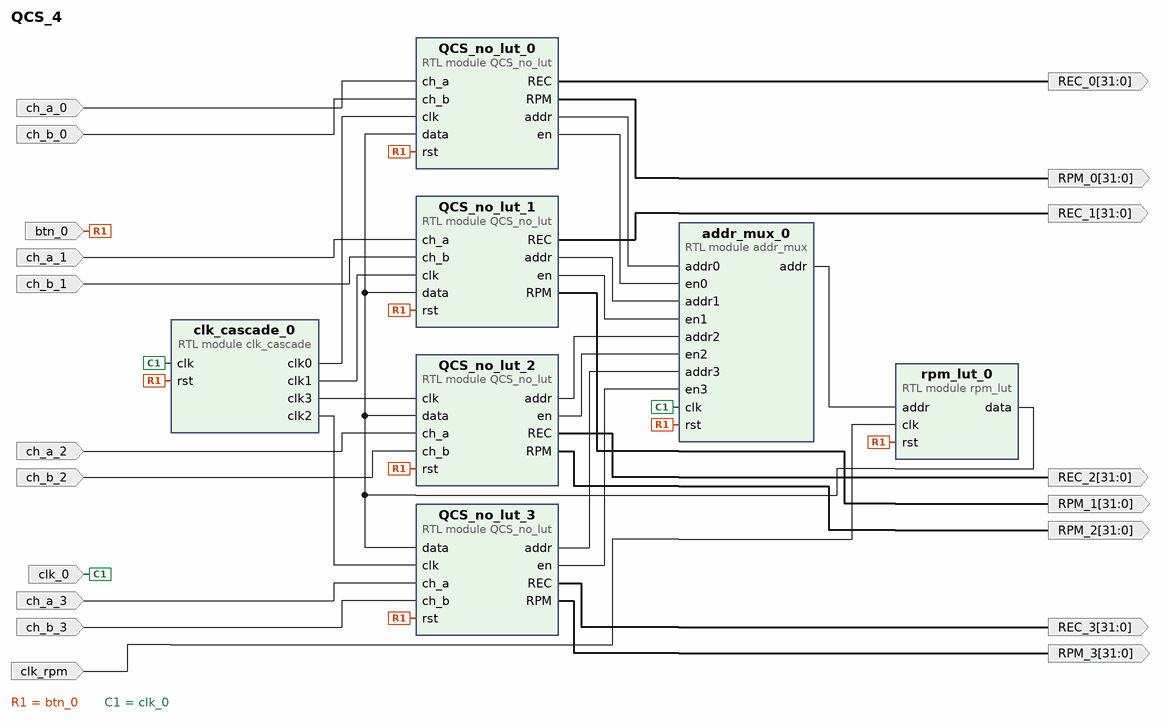
[diagram p0: block diagram of the top level]
# Vivado block design QCS_4, xc7a35ticsg324-1L, Vivado 2023.1
create_bd_design QCS_4

create_bd_port -dir O -from 31 -to 0 REC_0
create_bd_port -dir O -from 31 -to 0 RPM_0
create_bd_port -dir I ch_a_0
create_bd_port -dir I ch_b_0
create_bd_port -dir O -from 31 -to 0 REC_1
create_bd_port -dir O -from 31 -to 0 RPM_1
create_bd_port -dir I ch_a_1
create_bd_port -dir I ch_b_1
create_bd_port -dir O -from 31 -to 0 REC_2
create_bd_port -dir O -from 31 -to 0 RPM_2
create_bd_port -dir I ch_a_2
create_bd_port -dir I ch_b_2
create_bd_port -dir O -from 31 -to 0 REC_3
create_bd_port -dir O -from 31 -to 0 RPM_3
create_bd_port -dir I ch_a_3
create_bd_port -dir I ch_b_3
create_bd_port -dir I btn_0
create_bd_port -dir I -type clk clk_0
create_bd_port -dir I -type clk clk_rpm
set_property -dict {CONFIG.FREQ_HZ 400000000} [get_bd_ports clk_rpm]

create_bd_cell -type module -reference rpm_lut rpm_lut_0
create_bd_cell -type module -reference clk_cascade clk_cascade_0
create_bd_cell -type module -reference addr_mux addr_mux_0
create_bd_cell -type module -reference QCS_no_lut QCS_no_lut_0
create_bd_cell -type module -reference QCS_no_lut QCS_no_lut_1
create_bd_cell -type module -reference QCS_no_lut QCS_no_lut_2
create_bd_cell -type module -reference QCS_no_lut QCS_no_lut_3

# ---- connections ----

connect_bd_net [get_bd_ports btn_0] \
  [get_bd_pins rpm_lut_0/rst] [get_bd_pins clk_cascade_0/rst] [get_bd_pins addr_mux_0/rst] [get_bd_pins QCS_no_lut_0/rst] \
  [get_bd_pins QCS_no_lut_1/rst] [get_bd_pins QCS_no_lut_2/rst] [get_bd_pins QCS_no_lut_3/rst]
connect_bd_net [get_bd_pins rpm_lut_0/data] \
  [get_bd_pins QCS_no_lut_0/data] [get_bd_pins QCS_no_lut_1/data] [get_bd_pins QCS_no_lut_2/data] \
  [get_bd_pins QCS_no_lut_3/data]
connect_bd_net [get_bd_pins QCS_no_lut_0/REC] [get_bd_ports REC_0]
connect_bd_net [get_bd_pins QCS_no_lut_0/RPM] [get_bd_ports RPM_0]
connect_bd_net [get_bd_pins QCS_no_lut_0/addr] [get_bd_pins addr_mux_0/addr0]
connect_bd_net [get_bd_pins QCS_no_lut_0/en] [get_bd_pins addr_mux_0/en0]
connect_bd_net [get_bd_pins QCS_no_lut_1/REC] [get_bd_ports REC_1]
connect_bd_net [get_bd_pins QCS_no_lut_1/RPM] [get_bd_ports RPM_1]
connect_bd_net [get_bd_pins QCS_no_lut_1/addr] [get_bd_pins addr_mux_0/addr1]
connect_bd_net [get_bd_pins QCS_no_lut_1/en] [get_bd_pins addr_mux_0/en1]
connect_bd_net [get_bd_pins QCS_no_lut_2/REC] [get_bd_ports REC_2]
connect_bd_net [get_bd_pins QCS_no_lut_2/RPM] [get_bd_ports RPM_2]
connect_bd_net [get_bd_pins QCS_no_lut_2/addr] [get_bd_pins addr_mux_0/addr2]
connect_bd_net [get_bd_pins QCS_no_lut_2/en] [get_bd_pins addr_mux_0/en2]
connect_bd_net [get_bd_pins QCS_no_lut_3/REC] [get_bd_ports REC_3]
connect_bd_net [get_bd_pins QCS_no_lut_3/RPM] [get_bd_ports RPM_3]
connect_bd_net [get_bd_pins QCS_no_lut_3/addr] [get_bd_pins addr_mux_0/addr3]
connect_bd_net [get_bd_pins QCS_no_lut_3/en] [get_bd_pins addr_mux_0/en3]
connect_bd_net [get_bd_pins addr_mux_0/addr] [get_bd_pins rpm_lut_0/addr]
connect_bd_net -net ch_a_0_1 [get_bd_ports ch_a_0] [get_bd_pins QCS_no_lut_0/ch_a]
connect_bd_net -net ch_a_1_1 [get_bd_ports ch_a_1] [get_bd_pins QCS_no_lut_1/ch_a]
connect_bd_net -net ch_a_2_1 [get_bd_ports ch_a_2] [get_bd_pins QCS_no_lut_2/ch_a]
connect_bd_net -net ch_a_3_1 [get_bd_ports ch_a_3] [get_bd_pins QCS_no_lut_3/ch_a]
connect_bd_net -net ch_b_0_1 [get_bd_ports ch_b_0] [get_bd_pins QCS_no_lut_0/ch_b]
connect_bd_net -net ch_b_1_1 [get_bd_ports ch_b_1] [get_bd_pins QCS_no_lut_1/ch_b]
connect_bd_net -net ch_b_2_1 [get_bd_ports ch_b_2] [get_bd_pins QCS_no_lut_2/ch_b]
connect_bd_net -net ch_b_3_1 [get_bd_ports ch_b_3] [get_bd_pins QCS_no_lut_3/ch_b]
connect_bd_net -net clk_2_1 [get_bd_ports clk_0] [get_bd_pins clk_cascade_0/clk] [get_bd_pins addr_mux_0/clk]
connect_bd_net -net clk_3_1 [get_bd_ports clk_rpm] [get_bd_pins rpm_lut_0/clk]
connect_bd_net [get_bd_pins clk_cascade_0/clk0] [get_bd_pins QCS_no_lut_0/clk]
connect_bd_net [get_bd_pins clk_cascade_0/clk1] [get_bd_pins QCS_no_lut_1/clk]
connect_bd_net [get_bd_pins clk_cascade_0/clk2] [get_bd_pins QCS_no_lut_3/clk]
connect_bd_net [get_bd_pins clk_cascade_0/clk3] [get_bd_pins QCS_no_lut_2/clk]

validate_bd_design
save_bd_design
